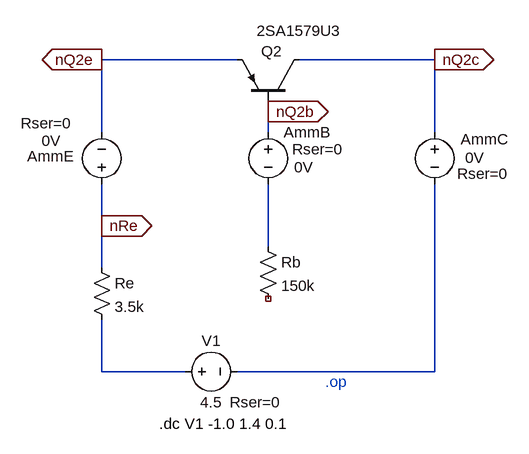
[diagram p0: schematic leakage_current_02.asc]
leakage_current_02.asc, the LTspice schematic file:
Version 4
SHEET 1 880 768
WIRE -80 176 -288 176
WIRE 224 176 16 176
WIRE -32 256 -32 240
WIRE -288 288 -288 176
WIRE -32 288 -32 256
WIRE 224 288 224 176
WIRE -288 432 -288 368
WIRE -32 464 -32 368
WIRE -288 496 -288 432
WIRE -288 656 -288 576
WIRE -160 656 -288 656
WIRE 224 656 224 368
WIRE 224 656 -80 656
FLAG -288 176 nQ2e
IOPIN -288 176 Out
FLAG -288 432 nRe
IOPIN -288 432 Out
FLAG -32 256 nQ2b
IOPIN -32 256 Out
FLAG 224 176 nQ2c
IOPIN 224 176 Out
SYMBOL pnp 16 240 M270
WINDOW 0 77 59 VLeft 2
WINDOW 3 108 66 VLeft 2
SYMATTR InstName Q2
SYMATTR Value 2SA1579U3
SYMBOL voltage -288 384 R180
WINDOW 0 43 59 Left 2
WINDOW 3 63 83 Left 2
WINDOW 123 0 0 Left 0
WINDOW 39 46 110 Left 2
SYMATTR InstName AmmE
SYMATTR Value 0V
SYMATTR SpiceLine Rser=0
SYMBOL voltage -32 272 R0
WINDOW 3 40 70 Left 2
WINDOW 123 0 0 Left 0
WINDOW 39 37 42 Left 2
SYMATTR Value 0V
SYMATTR SpiceLine Rser=0
SYMATTR InstName AmmB
SYMBOL voltage 224 272 R0
WINDOW 0 40 27 Left 2
WINDOW 3 47 55 Left 2
WINDOW 123 0 0 Left 0
WINDOW 39 35 80 Left 2
SYMATTR InstName AmmC
SYMATTR Value 0V
SYMATTR SpiceLine Rser=0
SYMBOL voltage -176 656 R270
WINDOW 0 32 56 VTop 2
WINDOW 3 -32 56 VBottom 2
WINDOW 123 0 0 Left 0
WINDOW 39 -32 124 VBottom 2
SYMATTR InstName V1
SYMATTR Value 4.5
SYMATTR SpiceLine Rser=0
SYMBOL res -304 480 R0
SYMATTR InstName Re
SYMATTR Value 3.5k
SYMBOL res -48 448 R0
SYMATTR InstName Rb
SYMATTR Value 150k
TEXT 56 672 Left 2 ;.op
TEXT -200 736 Left 2 !.dc V1 -1.0 1.4 0.1

The netlist it stands for:
* leakage_current_02.asc
Q2 nQ2c nQ2b nQ2e 0 2SA1579U3
V§AmmE nRe nQ2e 0V Rser=0
V§AmmB nQ2b N001 0V Rser=0
V§AmmC nQ2c N003 0V Rser=0
V1 N002 N003 4.5 Rser=0
Re nRe N002 3.5k
Rb N001 NC_01 150k
.model NPN NPN
.model PNP PNP
.lib standard.bjt
* .op
.dc V1 -1.0 1.4 0.1
.backanno
.end